# Altium schematic sheet Sheet1.SchDoc
size A4
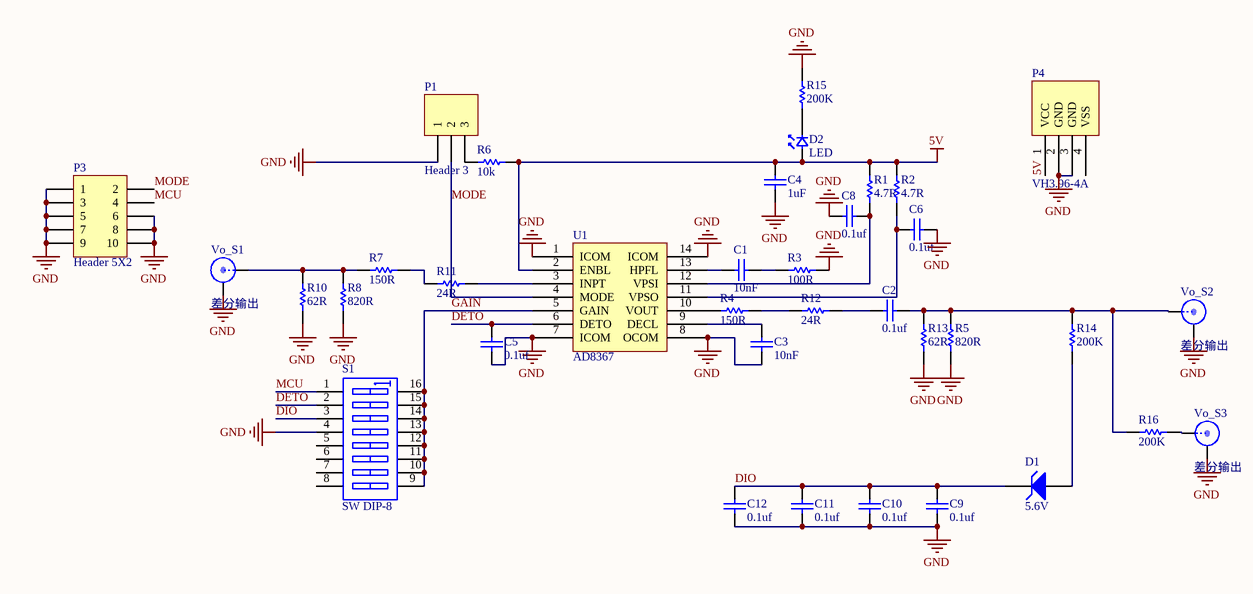
[diagram p0: Sheet1.SchDoc]

## Parts
C1  10nF  [0805]
C2  0.1uf  [0805]
C3  10nF  [0805]
C4  1uF  [0805]
C5  0.1uf  [0805]
C6  0.1uf  [0805]
C8  0.1uf  [0805]
C9  0.1uf  [0805]
C10  0.1uf  [0805]
C11  0.1uf  [0805]
C12  0.1uf  [0805]
D1  5.6V  [SMA/DO-214AC]
D2  LED  [0805_s]
P1  Header 3  [HDR1X3]
P3  Header 5X2  [HDR2X5]
P4  VH3.96-4A  [VH3.96-4P]
R1  4.7R  [0805]
R2  4.7R  [0805]
R3  100R  [0805]
R4  150R  [0805]
R5  820R  [0805]
R6  10k  [0805]
R7  150R  [0805]
R8  820R  [0805]
R10  62R  [0805]
R11  24R  [0805]
R12  24R  [0805]
R13  62R  [0805]
R14  200K  [0805]
R15  200K  [0805]
R16  200K  [0805]
S1  SW DIP-8  [DIP-16]
U1  AD8367  [TSSOP14_M]
Vo_S1  差分输出  [SMA-LYING]
Vo_S2  差分输出  [SMA-LYING]
Vo_S3  差分输出  [SMA-LYING]

## Nets
5V: C4.2 D2.2 P4.1(VCC) R1.2 R2.2 R6.1 U1.2(ENBL)
GND: C3.1 C4.1 C5.1 C6.1 C8.1 C9.1 C10.1 C11.2 C12.2 P1.1 P3.1 P3.3 P3.5 P3.6 P3.7 P3.8 P3.9 P3.10 P4.2(GND) P4.3(GND) R3.1 R5.1 R8.1 R10.1 R13.1 R15.2 S1.4(A4) U1.1(ICOM) U1.7(ICOM) U1.8(OCOM) U1.14(ICOM) Vo_S1.1 Vo_S2.1 Vo_S3.1
DETO: C5.2 S1.2(A2) U1.6(DETO)
DIO: C9.2 C10.2 C11.1 C12.1 D1.2(K) S1.3(A3)
GAIN: S1.9(B8) S1.10(B7) S1.11(B6) S1.12(B5) S1.13(B4) S1.14(B3) S1.15(B2) S1.16(B1) U1.5(GAIN)
MCU: P3.4 S1.1(A1)
MODE: P1.2 P3.2 U1.4(MODE)
NetC1_1: C1.1 R3.2
NetC1_2: C1.2 U1.13(HPFL)
NetC2_1: C2.1 R5.2 R13.2 R14.2 R16.1 Vo_S2.0
NetC2_2: C2.2 R12.2
NetC3_2: C3.2 U1.9(DECL)
NetC6_2: C6.2 R2.1 U1.11(VPSO)
NetC8_2: C8.2 R1.1 U1.12(VPSI)
NetD1_1: D1.1(A) R14.1
NetD2_1: D2.1 R15.1
NetP1_3: P1.3 R6.2
NetR4_1: R4.1 R12.1
NetR4_2: R4.2 U1.10(VOUT)
NetR7_1: R7.1 R11.1
NetR7_2: R7.2 R8.2 R10.2 Vo_S1.0
NetR11_2: R11.2 U1.3(INPT)
NetR16_2: R16.2 Vo_S3.0

Not connected (* = marked no-connect by the designer): P4 4(VSS); S1 5(A5) 6(A6) 7(A7) 8(A8)

## Library data of the parts
C1-C6 C8-C12 = Cap
D1 = 肖特基-5.6V
P1 = Header 3: Header, 3-Pin; LatestRevisionDate: 17-Jul-2002; LatestRevisionNote: Re-released for DXP Platform.; Publisher: Altium Limited
P3 = Header 5X2: Header, 5-Pin, Dual row; LatestRevisionDate: 17-Jul-2002; LatestRevisionNote: Re-released for DXP Platform.; Publisher: Altium Limited
R1-R8 R10-R16 = Res
S1 = SW DIP-8: DIP Switch, 8 Position, SPST; Published: 24-Mar-1999; LatestRevisionDate: 17-Jul-2002; LatestRevisionNote: Re-released for DXP Platform.; PackageReference: DIP_SW_8WAY_SMD; Publisher: Altium Limited; PackageDescription: DIP Switch; 16 Leads
Vo_S1-Vo_S3 = SMA